# EAGLE design tiny (EAGLE 9.6.1)
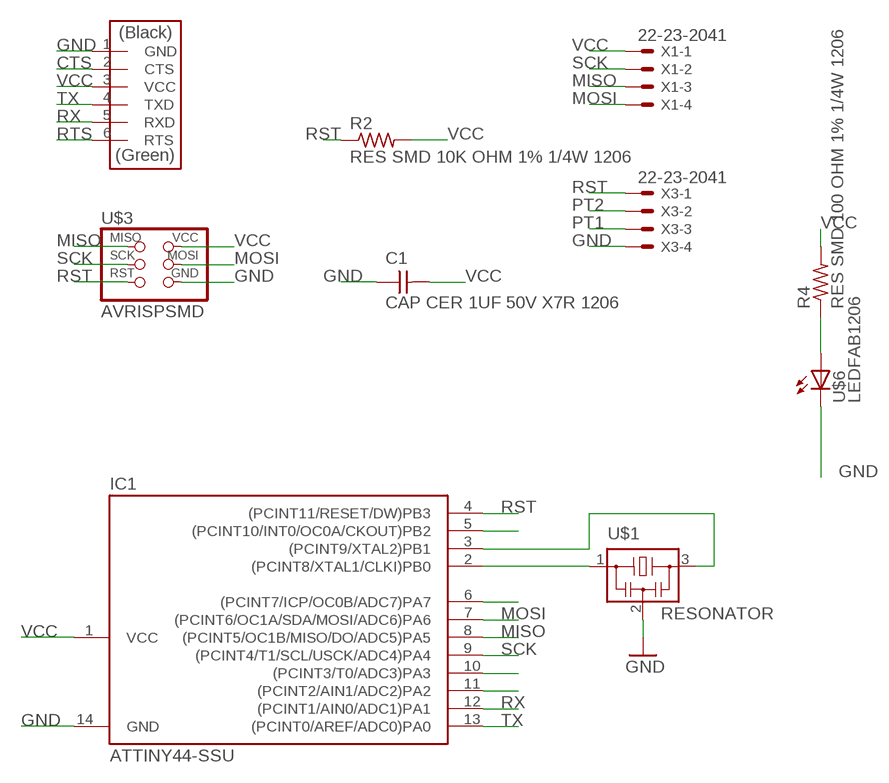
[diagram p0: schematic, sheet 1]

## Parts
C1  CAP CER 1UF 50V X7R 1206  CAP-UNPOLARIZEDFAB  [C1206FAB]
IC1  ATTINY44-SSU  [SOIC14]
R2  RES SMD 10K OHM 1% 1/4W 1206  RES-US1206FAB  [R1206FAB]
R4  RES SMD 100 OHM 1% 1/4W 1206  RES-US1206FAB  [R1206FAB]
U$1  RESONATOR  [EFOBM]
U$2  FTDI-SMD-HEADER  [1X06SMD]
U$3  AVRISPSMD  [2X03SMD]
U$6  LEDFAB1206  [LED1206FAB]
X1  22-23-2041  [22-23-2041]
X3  22-23-2041  [22-23-2041]

## Nets
CTS: U$2.2(CTS)
GND: C1.1 IC1.14(GND) U$1.2 U$2.1(GND) U$3.6(GND) U$6.2(C) X3.4
MISO: IC1.8((PCINT5/OC1B/MISO/DO/ADC5)PA5) U$3.1(MISO) X1.3
MOSI: IC1.7((PCINT6/OC1A/SDA/MOSI/ADC6)PA6) U$3.4(MOSI) X1.4
N$2: IC1.5((PCINT10/INT0/OC0A/CKOUT)PB2)
N$3: IC1.3((PCINT9/XTAL2)PB1) U$1.3
N$4: IC1.2((PCINT8/XTAL1/CLKI)PB0) U$1.1
N$5: IC1.6((PCINT7/ICP/OC0B/ADC7)PA7)
N$9: IC1.10((PCINT3/T0/ADC3)PA3)
N$10: IC1.11((PCINT2/AIN1/ADC2)PA2)
PB2: R4.1 U$6.1(A)
PT1: X3.3
PT2: X3.2
RST: IC1.4((PCINT11/RESET/DW)PB3) R2.1 U$3.5(RST) X3.1
RTS: U$2.6(RTS)
RX: IC1.12((PCINT1/AIN0/ADC1)PA1) U$2.5(RXD)
SCK: IC1.9((PCINT4/T1/SCL/USCK/ADC4)PA4) U$3.3(SCK) X1.2
TX: IC1.13((PCINT0/AREF/ADC0)PA0) U$2.4(TXD)
VCC: C1.2 IC1.1(VCC) R2.2 R4.2 U$2.3(VCC) U$3.2(VCC) X1.1

## Library data of the parts
C1 = fab:CAP-UNPOLARIZED
IC1 = fab:ATTINY44
R2 R4 = fab:RES-US: Resistor (US Symbol) Variants with postfix FAB are widened to allow the routing of internal traces
U$1 = fab:RESONATOR; MF: Abracon Corporation; MPN: AWSCR-20.00MTD-T; OC_NEWARK: 13J2006
U$2 = fab:FTDI-SMD-HEADER
U$3 = fab:AVRISP
U$6 = fab:LED: LED
X1 X3 = con-molex:22-23-2041: .100" (2.54mm) Center Header - 4 Pin; MF: MOLEX; MPN: 22-23-2041; OC_FARNELL: 1462920; OC_NEWARK: 38C0355

## Board
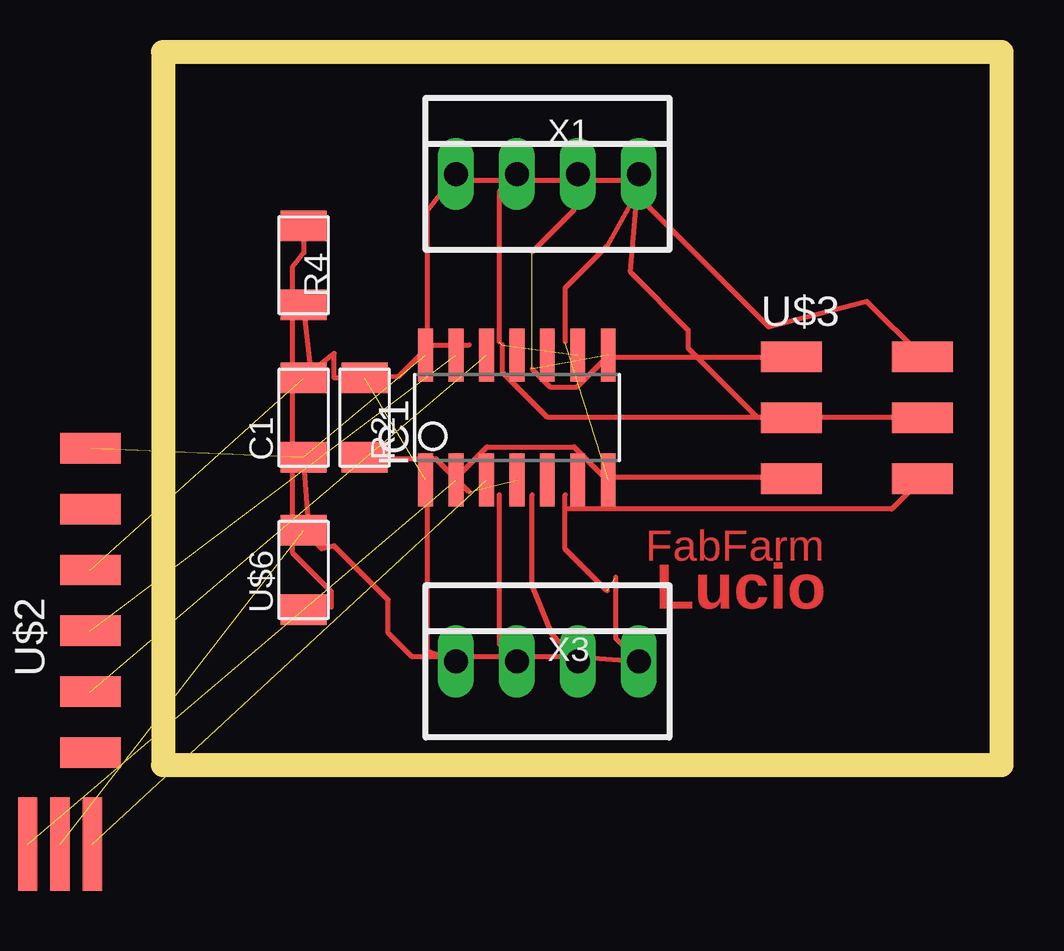
[diagram p1: board, top side]

Size 34.65 x 29.18 mm. Coordinates in mm from the lower left corner, seen from the top.
Outline: 0,0 34.65,0 34.65,29.18 0,29.18 0,0
Copper layers (1*16): Top 0.035mm / dielectric 1.5mm / Bottom 0.035mm
Design rules "default *": minimum track width 0.2mm, minimum drill 0.35mm, track to track 25mil, track to pad 25mil, pad to pad 25mil, via to via 25mil, smd to smd 25mil, copper to edge 10mil, drill to drill 6mil, minimum pad ring 10mil, minimum via ring 8mil, stop-mask expansion 4mil, vias tented up to drill 0mil, thermal gap 10mil
Milling: 4 lines

### Footprints (pad centres in the part's own frame; a part is rotated, then mirrored left to right if it is on the bottom)
C1206FAB = smd 1.27 x 1.905: 1 -1.651,0; 2 1.651,0
SOIC14 = smd 0.61 x 2.21: 1 -3.81,-2.603; 2 -2.54,-2.603; 3 -1.27,-2.603; 4 0,-2.603; 5 1.27,-2.603; 6 2.54,-2.603; 7 3.81,-2.603; 8 3.81,2.603; 9 2.54,2.603; 10 1.27,2.603; 11 0,2.603; 12 -1.27,2.603; 13 -2.54,2.603; 14 -3.81,2.603
R1206FAB = smd 1.27 x 1.905: 1 -1.651,0; 2 1.651,0
EFOBM = smd 0.8 x 3.9: 1 -1.35,0; 2 0,0; 3 1.35,0
1X06SMD = smd 2.54 x 1.27: 1 0,6.35; 2 0,3.81; 3 0,1.27; 4 0,-1.27; 5 0,-3.81; 6 0,-6.35
2X03SMD = smd 2.54 x 1.27: 1 -2.54,2.54; 2 2.92,2.54; 3 -2.54,0; 4 2.92,0; 5 -2.54,-2.54; 6 2.92,-2.54
LED1206FAB = smd 1.27 x 1.905: 1 -1.651,0; 2 1.651,0
22-23-2041 = drill 1 long: 1 -3.81,0; 2 -1.27,0; 3 1.27,0; 4 3.81,0

### Placement (x,y rotation side)
C1  5.46,14.27 90 top
IC1  14.35,14.27 0 top
R2  8,14.27 90 top
R4  5.46,20.62 270 top
U$1  -4.7,-3.51 0 top  (outside the outline)
U$2  -3.43,6.65 0 top  (outside the outline)
U$3  28.32,14.27 0 top
U$6  5.46,7.92 90 top
X1  15.62,24.43 0 top
X3  15.62,4.11 0 top

### Tracks (layer width: path | path; a pad name or v marks a point on that pad's centre or on a via)
GND  (4 unrouted)
  Top 0.2: C1.1 5.66,9.84 U$6.2 6.23,8.8 6.74,8.93 8.98,6.67 8.98,5.3 9.98,4.3 16.96,4.3 X3.4 | 16.36,10.46 16.36,8.8 18.11,7.05 | 16.36,10.46 16.36,11.05 | 19.38,4.13 X3.4 | 18.46,7.62 18.46,5.08 X3.4 | U$3.6 29.97,10.46 16.36,10.46
MISO  (2 unrouted)
  Top 0.2: 14.98,21.18 16.72,22.91 X1.3 | 14.98,16.3 15.73,15.55 16.86,15.55 18.11,16.8 25.71,16.8 U$3.1
MOSI  (1 unrouted)
  Top 0.2: 16.36,17.43 16.36,19.68 18.11,21.43 19.18,23.35 X1.4 19.08,20.33 21.48,17.93 21.48,17.18 24.36,14.3 31.21,14.3 U$3.4
N$3  (1 unrouted)
N$4  (1 unrouted)
PB2
  Top 0.2: U$6.1 6.61,6.37 6.61,7.03 4.99,8.66 4.99,20.55 5.46,21.14 R4.1
PT1
  Top 0.2: 14.98,11.05 14.98,7.3 15.81,5.25 X3.3
PT2
  Top 0.2: 13.61,11.05 13.61,4.85 X3.2
RST  (1 unrouted)
  Top 0.2: 10.61,12.55 10.98,12.55 11.8,11.74 | 10.61,12.55 8.09,12.55 R2.1 | 12.36,11.18 11.8,11.74 | 11.8,11.74 13.11,13.05 16.73,13.05 17.98,11.8 25.71,11.8 U$3.5 | 10.61,12.55 10.61,4.54 X3.1
RX  (1 unrouted)
SCK  (2 unrouted)
  Top 0.2: X1.2 13.61,23.69 13.61,17.43 | 13.73,17.3 13.73,16.18 15.61,14.3 25.71,14.3 U$3.3
TX  (1 unrouted)
VCC  (2 unrouted)
  Top 0.2: 5.78,16.18 R4.2 | 5.78,16.18 6.74,16.94 6.74,15.93 7.97,15.93 R2.2 9.42,15.98 10.67,17.24 | 5.78,16.18 C1.2 | 12.36,17.3 10.73,17.3 10.67,17.24 | U$3.2 28.94,19.11 24.86,18.05 18.73,24.18 12.48,24.18 12.36,24.43 X1.1 10.61,22.89 10.61,17.3 10.67,17.24

### Text on the board
Top: FabFarm | Lucio